# EAGLE schematic repráksch (EAGLE 9.6.2)
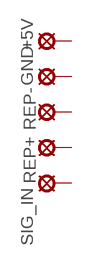
[diagram p0: schematic, sheet 1]

## Parts
+5V  LSP11  [LSP11]
GND  LSP11  [LSP11]
REP+  LSP11  [LSP11]
REP-  LSP11  [LSP11]
SIG_IN  LSP11  [LSP11]
Unconnected: +5V.MP GND.MP REP+.MP REP-.MP SIG_IN.MP

## Library data of the parts
+5V GND REP+ REP- SIG_IN = solpad:LSP11: SOLDER PAD drill 1.1 mm